# Altium schematic sheet input_filter.SchDoc: foxBMS BMS-Slave 12-Cell
size A3; DocumentNumber: 4; SheetNumber: 4; SheetTotal: 15; AUTHOR: Fraunhofer IISB foxBMS Team; SheetDescription: Primary Voltage Measurement
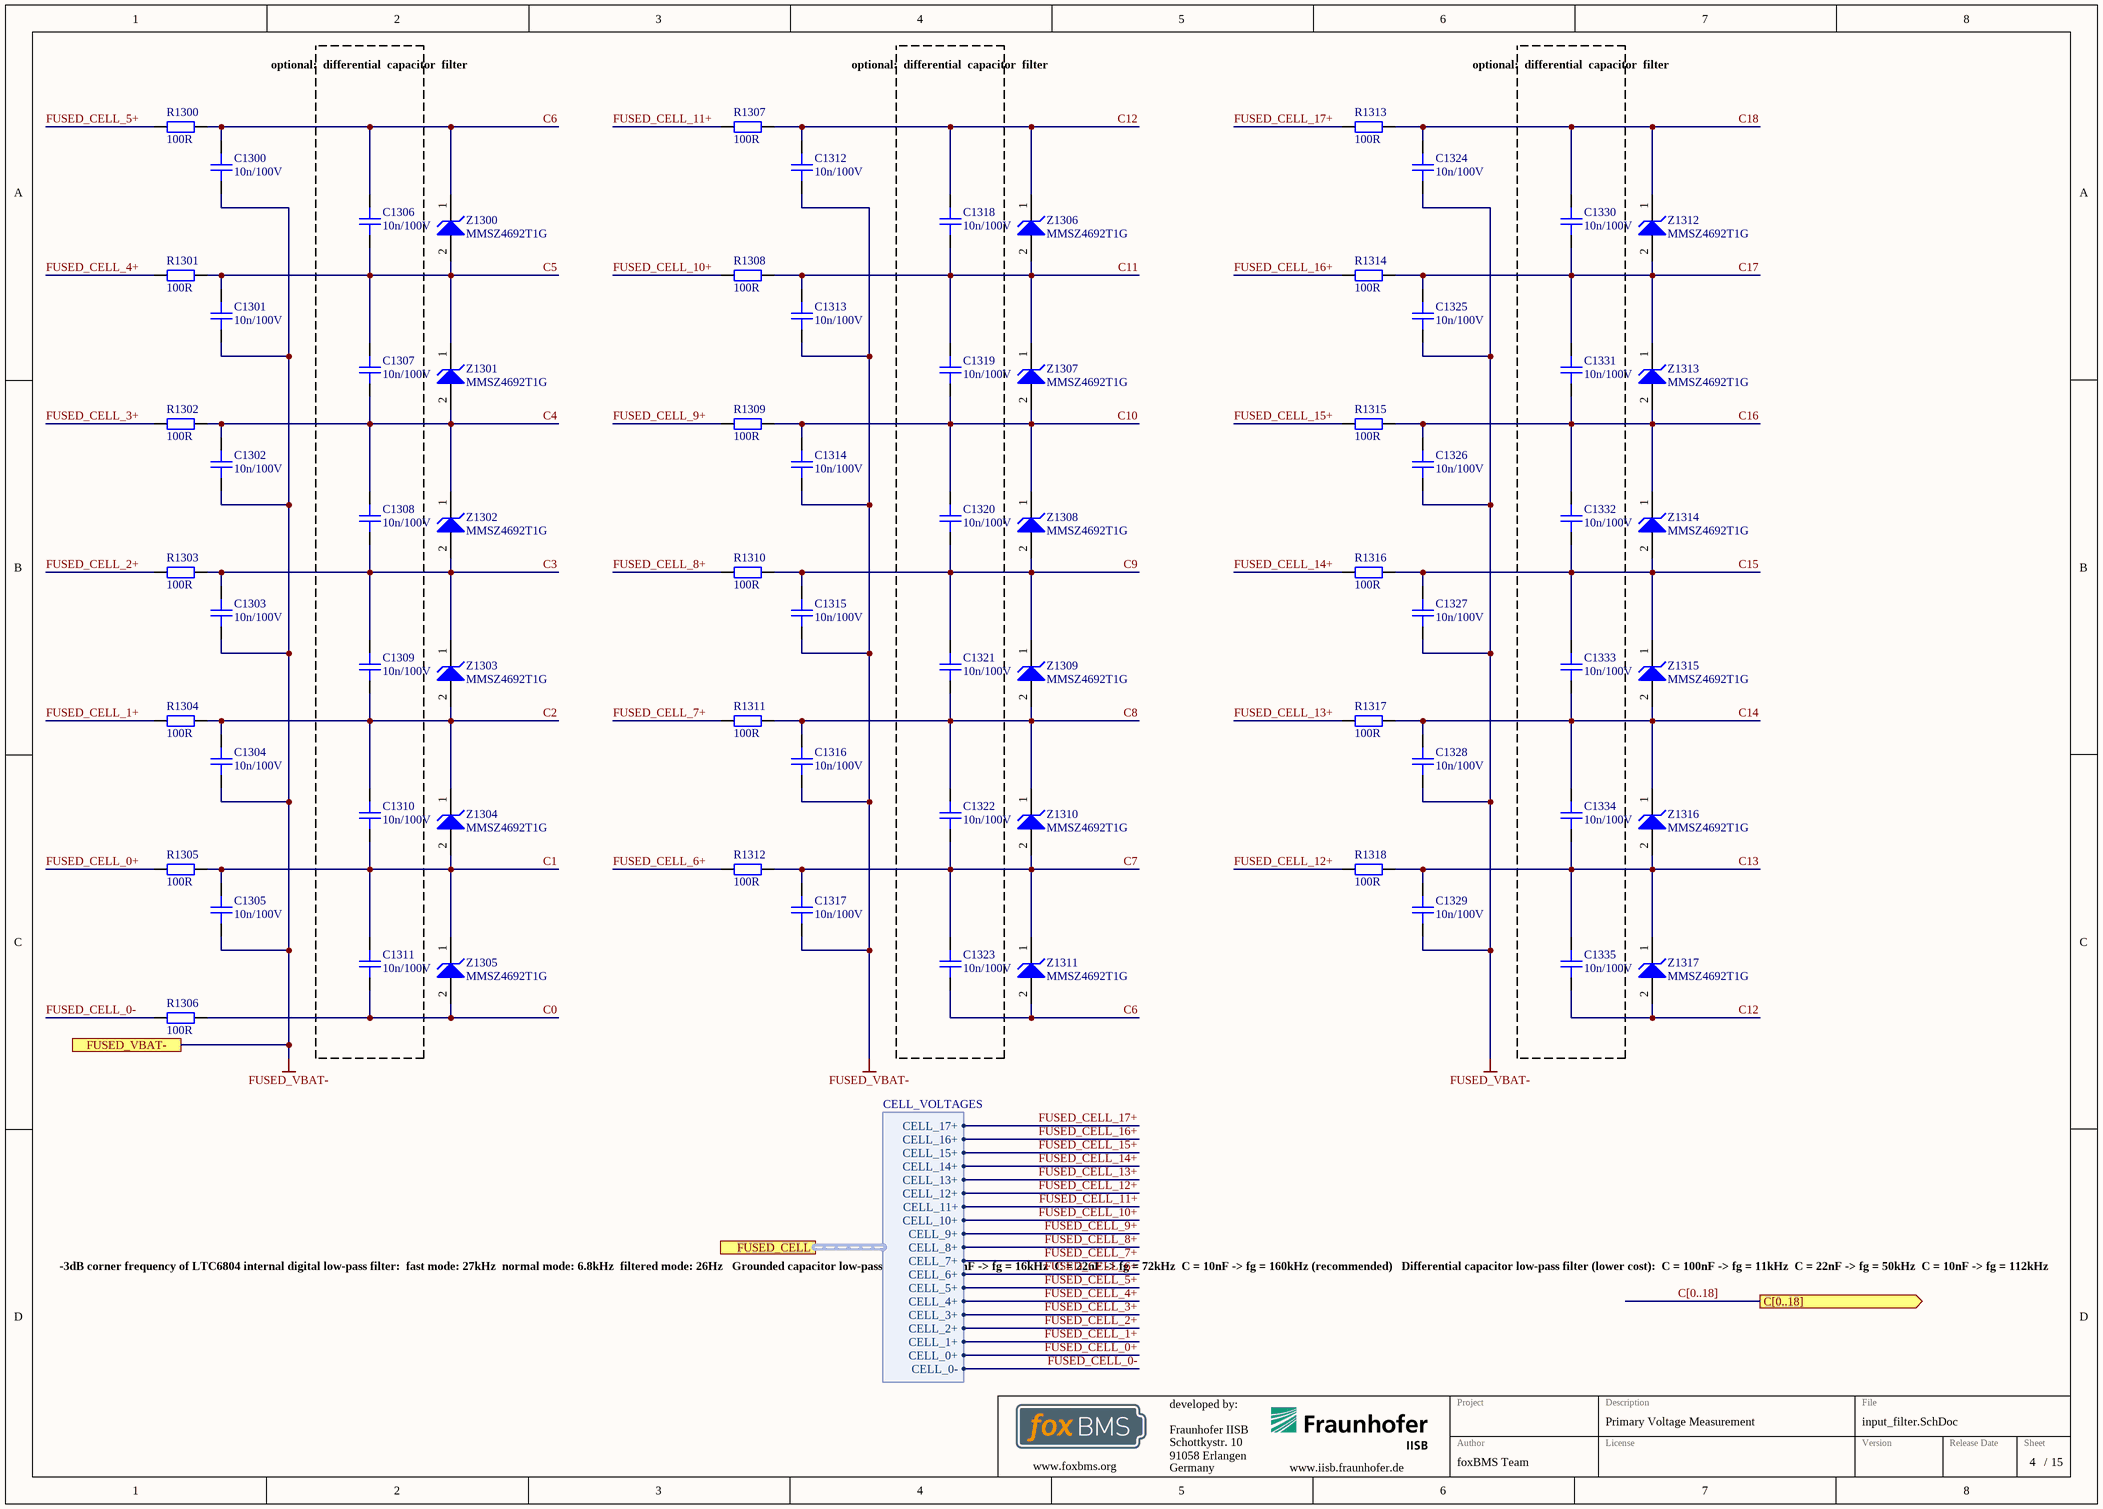
[diagram p0: input_filter.SchDoc]

## Parts
C1300  10n/100V  [CAPC1608X08N]
C1301  10n/100V  [CAPC1608X08N]
C1302  10n/100V  [CAPC1608X08N]
C1303  10n/100V  [CAPC1608X08N]
C1304  10n/100V  [CAPC1608X08N]
C1305  10n/100V  [CAPC1608X08N]
C1306  10n/100V  [CAPC1608X08N]
C1307  10n/100V  [CAPC1608X08N]
C1308  10n/100V  [CAPC1608X08N]
C1309  10n/100V  [CAPC1608X08N]
C1310  10n/100V  [CAPC1608X08N]
C1311  10n/100V  [CAPC1608X08N]
C1312  10n/100V  [CAPC1608X08N]
C1313  10n/100V  [CAPC1608X08N]
C1314  10n/100V  [CAPC1608X08N]
C1315  10n/100V  [CAPC1608X08N]
C1316  10n/100V  [CAPC1608X08N]
C1317  10n/100V  [CAPC1608X08N]
C1318  10n/100V  [CAPC1608X08N]
C1319  10n/100V  [CAPC1608X08N]
C1320  10n/100V  [CAPC1608X08N]
C1321  10n/100V  [CAPC1608X08N]
C1322  10n/100V  [CAPC1608X08N]
C1323  10n/100V  [CAPC1608X08N]
C1324  10n/100V  [CAPC1608X08N]
C1325  10n/100V  [CAPC1608X08N]
C1326  10n/100V  [CAPC1608X08N]
C1327  10n/100V  [CAPC1608X08N]
C1328  10n/100V  [CAPC1608X08N]
C1329  10n/100V  [CAPC1608X08N]
C1330  10n/100V  [CAPC1608X08N]
C1331  10n/100V  [CAPC1608X08N]
C1332  10n/100V  [CAPC1608X08N]
C1333  10n/100V  [CAPC1608X08N]
C1334  10n/100V  [CAPC1608X08N]
C1335  10n/100V  [CAPC1608X08N]
R1300  100R  [RESC1608X05N]
R1301  100R  [RESC1608X05N]
R1302  100R  [RESC1608X05N]
R1303  100R  [RESC1608X05N]
R1304  100R  [RESC1608X05N]
R1305  100R  [RESC1608X05N]
R1306  100R  [RESC1608X05N]
R1307  100R  [RESC1608X05N]
R1308  100R  [RESC1608X05N]
R1309  100R  [RESC1608X05N]
R1310  100R  [RESC1608X05N]
R1311  100R  [RESC1608X05N]
R1312  100R  [RESC1608X05N]
R1313  100R  [RESC1608X05N]
R1314  100R  [RESC1608X05N]
R1315  100R  [RESC1608X05N]
R1316  100R  [RESC1608X05N]
R1317  100R  [RESC1608X05N]
R1318  100R  [RESC1608X05N]
Z1300  MMSZ4692T1G  [ONSC-SOD-123-2-425-04_V]
Z1301  MMSZ4692T1G  [ONSC-SOD-123-2-425-04_V]
Z1302  MMSZ4692T1G  [ONSC-SOD-123-2-425-04_V]
Z1303  MMSZ4692T1G  [ONSC-SOD-123-2-425-04_V]
Z1304  MMSZ4692T1G  [ONSC-SOD-123-2-425-04_V]
Z1305  MMSZ4692T1G  [ONSC-SOD-123-2-425-04_V]
Z1306  MMSZ4692T1G  [ONSC-SOD-123-2-425-04_V]
Z1307  MMSZ4692T1G  [ONSC-SOD-123-2-425-04_V]
Z1308  MMSZ4692T1G  [ONSC-SOD-123-2-425-04_V]
Z1309  MMSZ4692T1G  [ONSC-SOD-123-2-425-04_V]
Z1310  MMSZ4692T1G  [ONSC-SOD-123-2-425-04_V]
Z1311  MMSZ4692T1G  [ONSC-SOD-123-2-425-04_V]
Z1312  MMSZ4692T1G  [ONSC-SOD-123-2-425-04_V]
Z1313  MMSZ4692T1G  [ONSC-SOD-123-2-425-04_V]
Z1314  MMSZ4692T1G  [ONSC-SOD-123-2-425-04_V]
Z1315  MMSZ4692T1G  [ONSC-SOD-123-2-425-04_V]
Z1316  MMSZ4692T1G  [ONSC-SOD-123-2-425-04_V]
Z1317  MMSZ4692T1G  [ONSC-SOD-123-2-425-04_V]

## Blocks framed on the sheet
optional: / differential / capacitor / filter: C1306-C1311
optional: / differential / capacitor / filter: C1318-C1323
optional: / differential / capacitor / filter: C1330-C1335

## Ports
C[0..18] (out), FUSED_CELL (harness CELL_VOLTAGES), FUSED_VBAT-

## Harnesses
CELL_VOLTAGES: CELL_0-, CELL_0+, CELL_1+, CELL_10+, CELL_11+, CELL_12+, CELL_13+, CELL_14+, CELL_15+, CELL_16+, CELL_17+, CELL_2+, CELL_3+, CELL_4+, CELL_5+, CELL_6+, CELL_7+, CELL_8+, CELL_9+

## Nets
FUSED_VBAT-: C1300.2 C1301.2 C1302.2 C1303.2 C1304.2 C1305.2 C1312.2 C1313.2 C1314.2 C1315.2 C1316.2 C1317.2 C1324.2 C1325.2 C1326.2 C1327.2 C1328.2 C1329.2 ; port FUSED_VBAT-
C0: C1311.2 R1306.2 Z1305.2(A)
C1: C1305.1 C1310.2 C1311.1 R1305.2 Z1304.2(A) Z1305.1(K)
C2: C1304.1 C1309.2 C1310.1 R1304.2 Z1303.2(A) Z1304.1(K)
C3: C1303.1 C1308.2 C1309.1 R1303.2 Z1302.2(A) Z1303.1(K)
C4: C1302.1 C1307.2 C1308.1 R1302.2 Z1301.2(A) Z1302.1(K)
C5: C1301.1 C1306.2 C1307.1 R1301.2 Z1300.2(A) Z1301.1(K)
C6: C1300.1 C1306.1 C1323.2 R1300.2 Z1300.1(K) Z1311.2(A)
C7: C1317.1 C1322.2 C1323.1 R1312.2 Z1310.2(A) Z1311.1(K)
C8: C1316.1 C1321.2 C1322.1 R1311.2 Z1309.2(A) Z1310.1(K)
C9: C1315.1 C1320.2 C1321.1 R1310.2 Z1308.2(A) Z1309.1(K)
C10: C1314.1 C1319.2 C1320.1 R1309.2 Z1307.2(A) Z1308.1(K)
C11: C1313.1 C1318.2 C1319.1 R1308.2 Z1306.2(A) Z1307.1(K)
C12: C1312.1 C1318.1 C1335.2 R1307.2 Z1306.1(K) Z1317.2(A)
C13: C1329.1 C1334.2 C1335.1 R1318.2 Z1316.2(A) Z1317.1(K)
C14: C1328.1 C1333.2 C1334.1 R1317.2 Z1315.2(A) Z1316.1(K)
C15: C1327.1 C1332.2 C1333.1 R1316.2 Z1314.2(A) Z1315.1(K)
C16: C1326.1 C1331.2 C1332.1 R1315.2 Z1313.2(A) Z1314.1(K)
C17: C1325.1 C1330.2 C1331.1 R1314.2 Z1312.2(A) Z1313.1(K)
C18: C1324.1 C1330.1 R1313.2 Z1312.1(K)
FUSED_CELL_0+: R1305.1 ; port FUSED_CELL.CELL_0+
FUSED_CELL_0-: R1306.1 ; port FUSED_CELL.CELL_0-
FUSED_CELL_1+: R1304.1 ; port FUSED_CELL.CELL_1+
FUSED_CELL_2+: R1303.1 ; port FUSED_CELL.CELL_2+
FUSED_CELL_3+: R1302.1 ; port FUSED_CELL.CELL_3+
FUSED_CELL_4+: R1301.1 ; port FUSED_CELL.CELL_4+
FUSED_CELL_5+: R1300.1 ; port FUSED_CELL.CELL_5+
FUSED_CELL_6+: R1312.1 ; port FUSED_CELL.CELL_6+
FUSED_CELL_7+: R1311.1 ; port FUSED_CELL.CELL_7+
FUSED_CELL_8+: R1310.1 ; port FUSED_CELL.CELL_8+
FUSED_CELL_9+: R1309.1 ; port FUSED_CELL.CELL_9+
FUSED_CELL_10+: R1308.1 ; port FUSED_CELL.CELL_10+
FUSED_CELL_11+: R1307.1 ; port FUSED_CELL.CELL_11+
FUSED_CELL_12+: R1318.1 ; port FUSED_CELL.CELL_12+
FUSED_CELL_13+: R1317.1 ; port FUSED_CELL.CELL_13+
FUSED_CELL_14+: R1316.1 ; port FUSED_CELL.CELL_14+
FUSED_CELL_15+: R1315.1 ; port FUSED_CELL.CELL_15+
FUSED_CELL_16+: R1314.1 ; port FUSED_CELL.CELL_16+
FUSED_CELL_17+: R1313.1 ; port FUSED_CELL.CELL_17+

## Buses and harness runs
bus C[0..18] = port C[0..18]

## Notes on the sheet
- -3dB corner frequency of LTC6804 internal digital low-pass filter:
  fast mode: 27kHz
  normal mode: 6.8kHz
  filtered mode: 26Hz
  Grounded capacitor low-pass filter:
  C = 100nF -> fg = 16kHz
  C = 22nF -> fg = 72kHz
  C = 10nF -> fg = 160kHz (recommended)
  Differential capacitor low-pass filter (lower cost):
  C = 100nF -> fg = 11kHz
  C = 22nF -> fg = 50kHz
  C = 10nF -> fg = 112kHz
- Fraunhofer IISB
- Schottkystr. 10
- developed by:
- 91058 Erlangen
- Germany
- Author
- Project
- License
- Description
- File
- Version
- Release Date
- Sheet
- www.foxbms.org
- www.iisb.fraunhofer.de
- foxBMS Team
- /

## Library data of the parts
C1300-C1335 = gen_C_ceramic_10n_100V_X7R_0603: MLCC; Capacitance: 10n; Rated Voltage: 100V; Dielectric: X7R; Case EIA: 0603; Case Metric: 1608; Automotive Qualified: True; Part Number: gen_C_ceramic_10n_100V_X7R_0603; Supplier 1: Farnell; Supplier Part Number 1: 1301715; Supplier 2: Farnell; Supplier Part Number 2: 2821192; Supplier 3: Farnell; Supplier Part Number 3: 2210878
R1300-R1318 = gen_R_100R_0603: SMD Resistor 100R 0603; Tolerance: 1%; Power: 0.1W; Case EIA: 0603; Case Metric: 1608; Maximum Working Voltage: 75V; PnP Package: R_0603; Automotive Qualified: True; Part Number: gen_R_100R_0603; Operating Temperature: -55°C - +155°C; Resistance: 100R; Series: E24, E96; PnP Value: 100R; Supplier 1: Farnell; Supplier Part Number 1: 2303059
Z1300-Z1317 = CMP-1060-00434-1: Zener Voltage Regulator, 500 mW, 2-Pin SOD-123, Pb-Free, Tape and Reel; Manufacturer: On Semiconductor; VZ Typ (V): 6.8; P Max (W): 0.5; ComponentLink2URL: http://www.onsemi.com/pub_link/Collateral/MMSZ4678T1-D.PDF; Mounting Technology: Surface Mount; DatasheetVersion: Rev. 9; ComponentLink1Description: Manufacturer URL; ComponentLink3URL: http://www.onsemi.com/pub_link/Collateral/425-04.PDF; PackageReference: SOD-123-2-425-04; ComponentLink2Description: Datasheet; RoHS: Pb-Free; Packing: Tape and Reel; ComponentLink1URL: http://www.onsemi.com/; PackageDescription: 2-Pin SOD, Body 1.6 x 2.69 mm; ComponentLink3Description: Package Specification; PartNumber: MMSZ4692T1G; PackageVersion: Rev. G, 10/2009